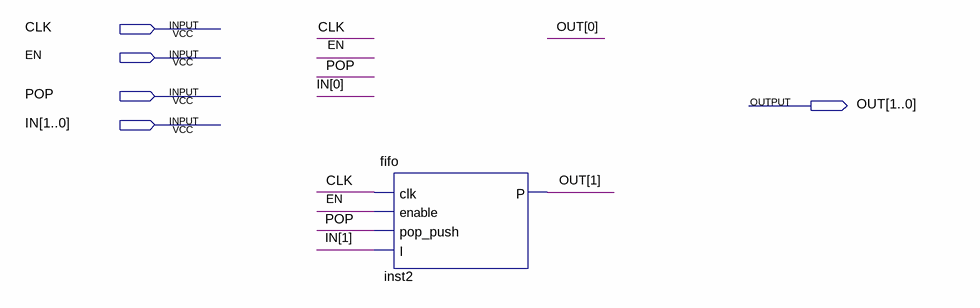
[diagram p0: schematic sheet]
// Quartus schematic fifo_TB.bdf as structural Verilog: 1 symbols, 5 pins
module fifo_TB (
  input  CLK,
  input  EN,
  input  POP,
  input  [1:0] IN,
  output [1:0] OUT
);

  fifo inst2 (.clk(CLK), .enable(EN), .pop_push(POP), .I(IN[1]), .P(OUT[1]));
endmodule
